# EAGLE design TPS92638 - Breakout (EAGLE 7.7.0)
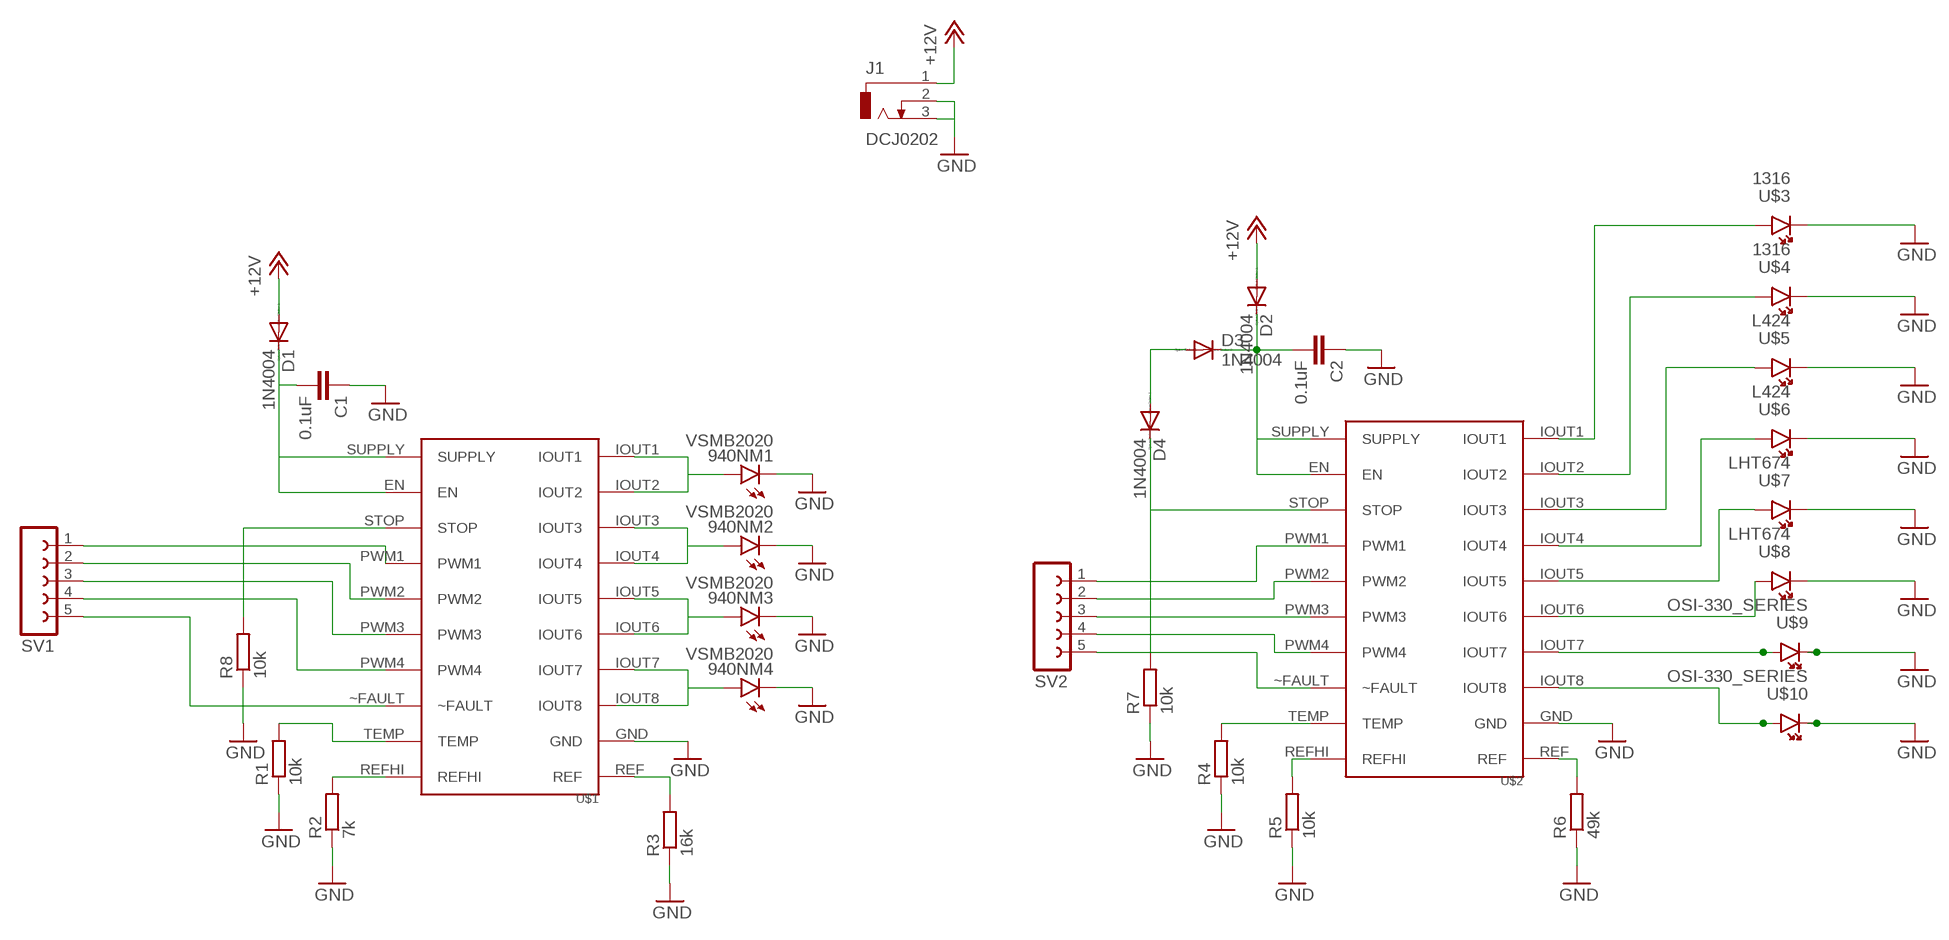
[diagram p0: schematic, sheet 1]

## Parts
940NM1  VSMB2020  [GULLWING-2.3MM]
940NM2  VSMB2020  [GULLWING-2.3MM]
940NM3  VSMB2020  [GULLWING-2.3MM]
940NM4  VSMB2020  [GULLWING-2.3MM]
C1  0.1uF  C-EUC0805  [C0805]
C2  0.1uF  C-EUC0805  [C0805]
D1  1N4004  [DO41-10]
D2  1N4004  [DO41-10]
D3  1N4004  [DO41-10]
D4  1N4004  [DO41-10]
J1  DCJ0202  [DCJ0202]
R1  10k  R-EU_M1206  [M1206]
R2  7k  R-EU_M1206  [M1206]
R3  16k  R-EU_M1206  [M1206]
R4  10k  R-EU_M1206  [M1206]
R5  10k  R-EU_M1206  [M1206]
R6  49k  R-EU_M1206  [M1206]
R7  10k  R-EU_M1206  [M1206]
R8  10k  R-EU_M1206  [M1206]
SV1  FE05-1  [FE05-1]
SV2  FE05-1  [FE05-1]
U$1  TPS92638  [TPS92638]
U$2  TPS92638  [TPS92638]
U$3  1316  [1316]
U$4  1316  [1316]
U$5  L424  [L424]
U$6  L424  [L424]
U$7  LHT674  [LHT674]
U$8  LHT674  [LHT674]
U$9  OSI-330_SERIES  [OSI-330_SERIES]
U$10  OSI-330_SERIES  [OSI-330_SERIES]

## Nets
+12V: D1.A D2.A J1.1
GND: 940NM1.P$2(C) 940NM2.P$2(C) 940NM3.P$2(C) 940NM4.P$2(C) C1.1 C2.1 J1.2 J1.3 R1.1 R2.1 R3.1 R4.1 R5.1 R6.1 R7.1 R8.1 U$1.GND U$2.GND U$3.CATHODE U$4.CATHODE U$5.CATHODE U$6.CATHODE U$7.CATHODE U$8.CATHODE U$9.CATHODE U$10.CATHODE
N$1: SV1.1 U$1.PWM1
N$2: SV1.2 U$1.PWM2
N$3: SV1.3 U$1.PWM3
N$4: SV1.4 U$1.PWM4
N$5: R8.2 U$1.STOP
N$6: SV2.1 U$2.PWM1
N$7: SV2.2 U$2.PWM2
N$8: SV2.3 U$2.PWM3
N$9: SV2.4 U$2.PWM4
N$10: D4.C R7.2 U$2.STOP
N$11: R2.2 U$1.REFHI
N$12: R1.2 U$1.TEMP
N$13: R3.2 U$1.REF
N$14: R4.2 U$2.TEMP
N$15: R5.2 U$2.REFHI
N$16: R6.2 U$2.REF
N$17: C1.2 D1.C U$1.EN U$1.SUPPLY
N$18: C2.2 D2.C D3.C U$2.EN U$2.SUPPLY
N$19: 940NM1.P$1(A) U$1.IOUT1 U$1.IOUT2
N$20: 940NM2.P$1(A) U$1.IOUT3 U$1.IOUT4
N$21: U$2.IOUT1 U$3.ANODE
N$22: 940NM3.P$1(A) U$1.IOUT5 U$1.IOUT6
N$23: 940NM4.P$1(A) U$1.IOUT7
N$24: U$2.IOUT2 U$4.ANODE
N$25: U$2.IOUT3 U$5.ANODE
N$26: U$2.IOUT4 U$6.ANODE
N$27: U$2.IOUT5 U$7.ANODE
N$28: U$2.IOUT6 U$8.ANODE
N$29: U$2.IOUT7 U$9.ANODE
N$30: U$2.IOUT8 U$10.ANODE
N$32: SV1.5 U$1.~FAULT
N$33: SV2.5 U$2.~FAULT
N$34: D3.A D4.A
Unconnected: U$1.IOUT8

## Library data of the parts
940NM1-940NM4 = VS:VSMB2020: VSMB2020X01 - ir led (940nm) in 2.3mm gullwing footprint from Vishay.
C1 C2 = rcl:C-EU: CAPACITOR, European symbol
D1-D4 = diode:1N4004: DIODE general purpose rectifier, 1 A
J1 = con-jack:DCJ0202: DC POWER JACK Source: DCJ0202.pdf; OC_FARNELL: unknown; OC_NEWARK: unknown
R1-R8 = rcl:R-EU_: RESISTOR, European symbol
SV1 SV2 = con-lsta:FE05-1: FEMALE HEADER; OC_FARNELL: unknown; OC_NEWARK: unknown
U$1 U$2 = TPS92638-Q1:TPS92638: The TPS92638-Q1 is an eight-channel linear LED driver with PWM dimming control.
U$3 U$4 = 1316:1316: Flex-System, THT LED’s. The housing is designed to accommodate Ø2mm light guides, i.e. 2000μm fibers and on request 1000μm fibers with a black coating are used.
U$5 U$6 = L424:L424: The Bright Red source color devices are made with Gallium Phosphide Red Light Emitting Diode
U$7 U$8 = LHT674:LHT674: TOPLED, SMT LED with integrated reflector. With our great experience in SMT LED we are able to offer a high quality product for all kind of applications.
U$9 U$10 = OSI-330_series:OSI-330_SERIES: Series 330 - 1206 with Lens IR high intensity 660-850 nm

## Board
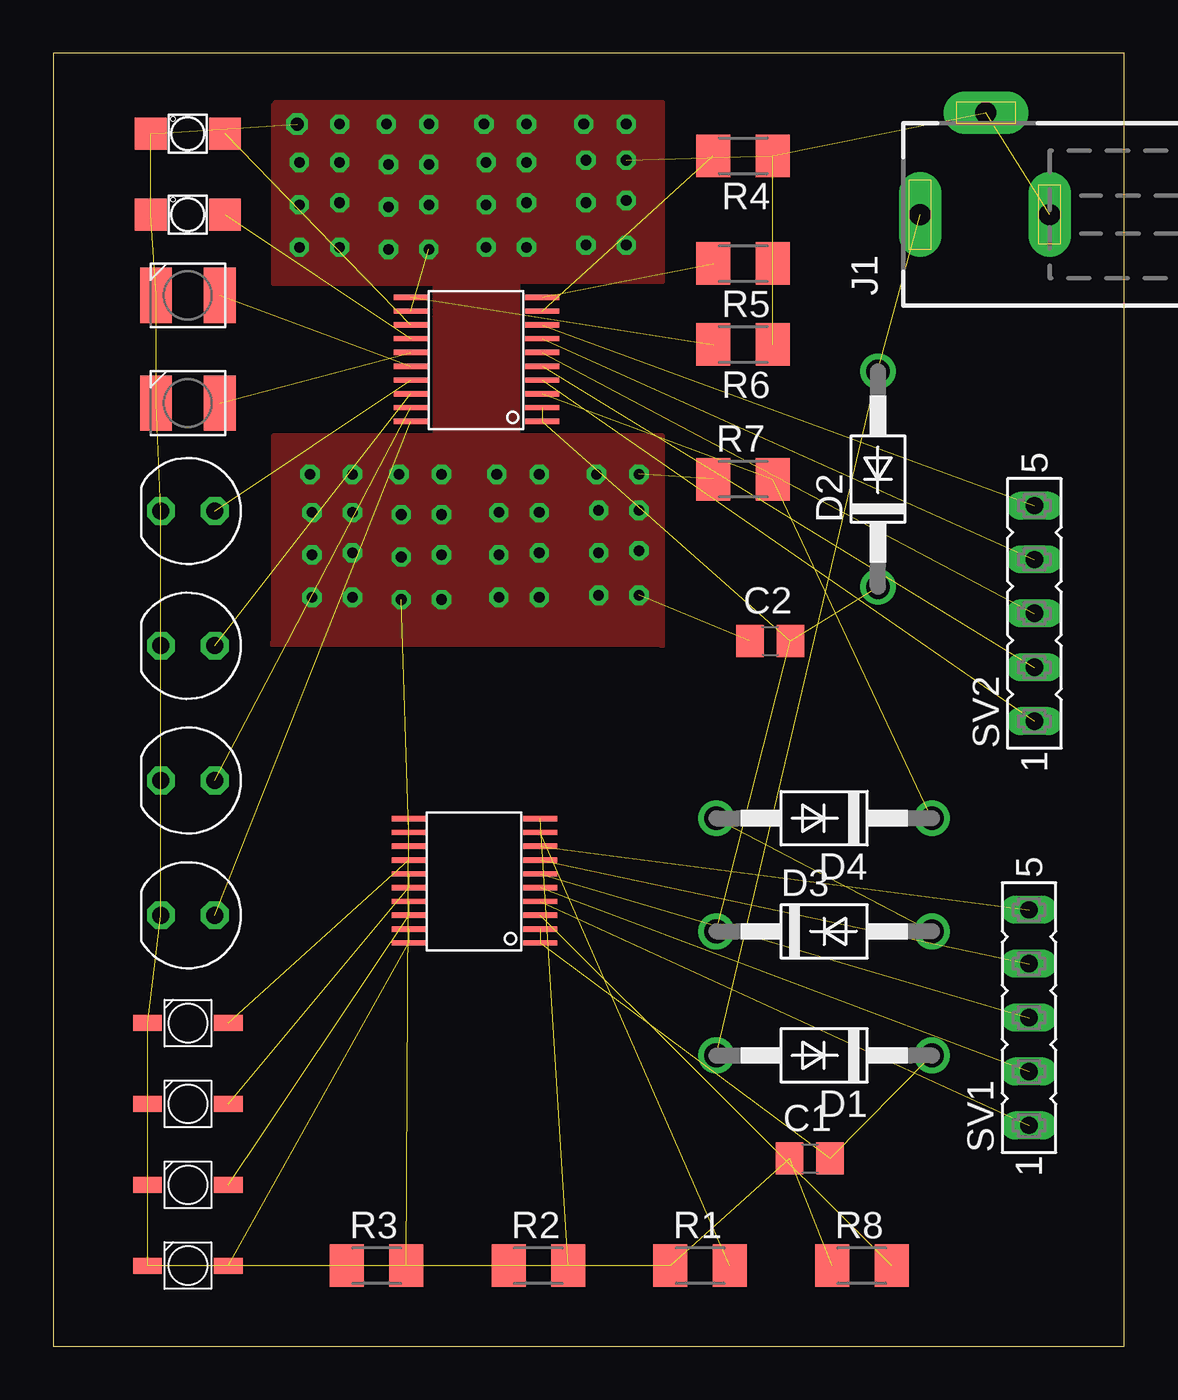
[diagram p1: board, top side]
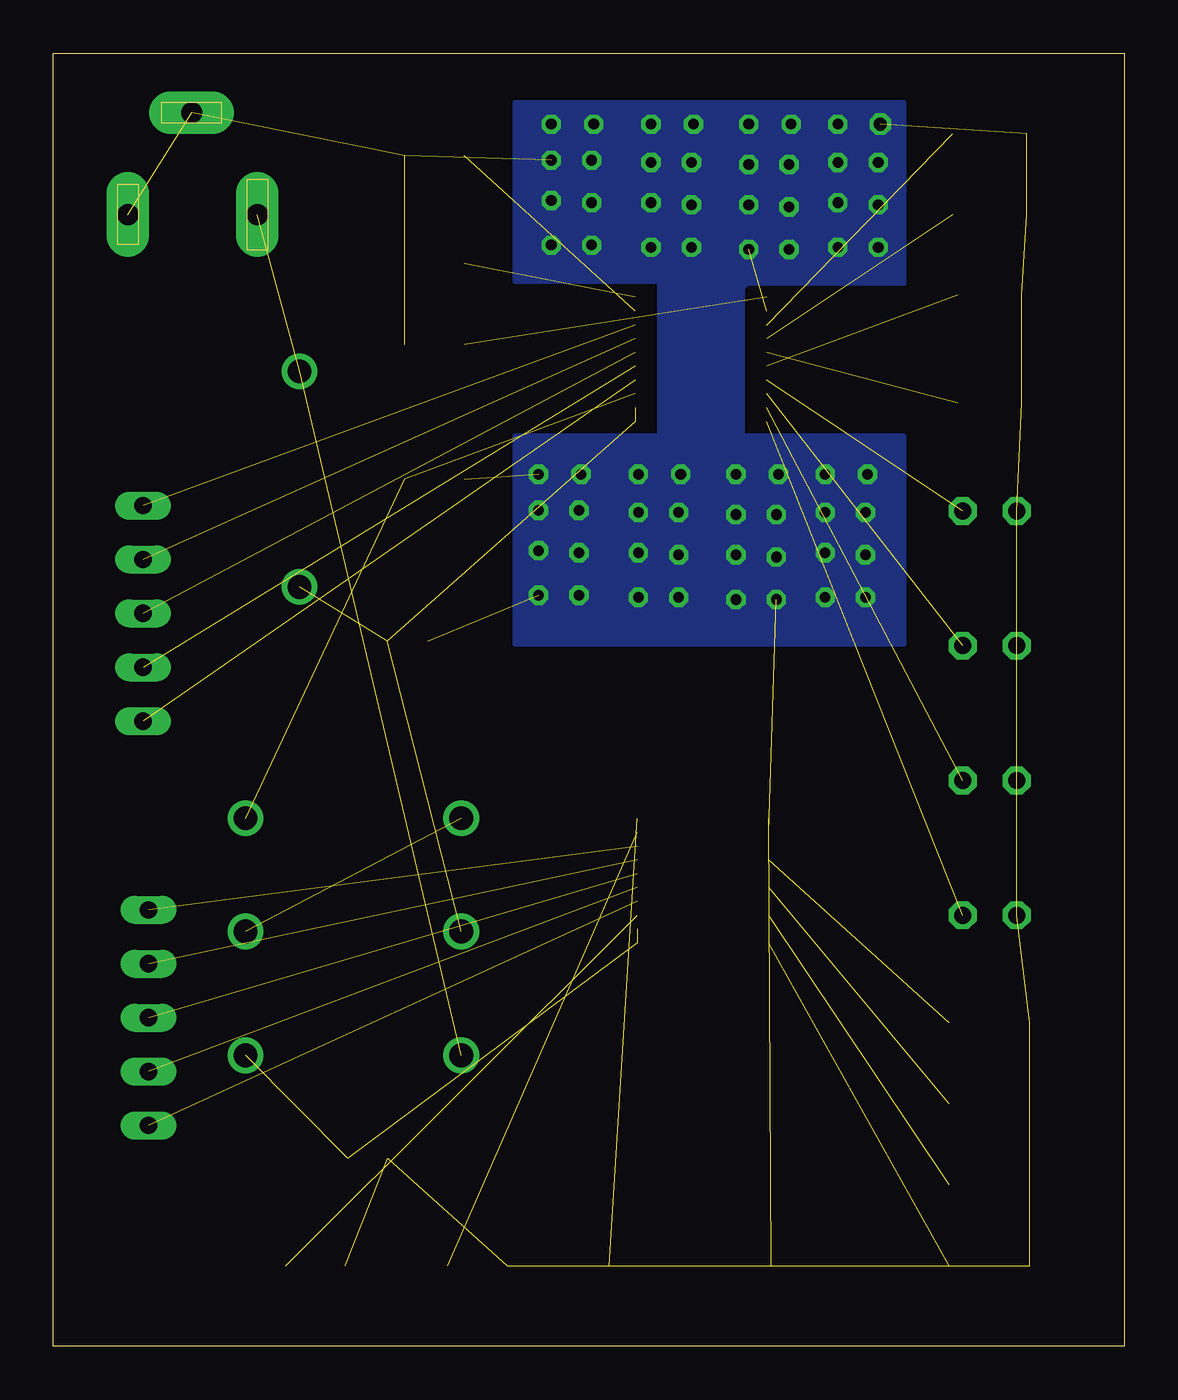
[diagram p2: board, bottom side, seen from below]

Size 50.47 x 60.95 mm. Coordinates in mm from the lower left corner, seen from the top.
Outline: 0,0 50.47,0 50.47,60.95 0,60.95 0,0
Copper layers (1*16): Top 0.035mm / dielectric 1.5mm / Bottom 0.035mm
Design rules "default": minimum track width 10mil, minimum drill 24mil, track to track 8mil, track to pad 8mil, pad to pad 8mil, via to via 8mil, smd to smd 8mil, copper to edge 40mil, drill to drill 8mil, minimum pad ring 10mil, minimum via ring 8mil, stop-mask expansion 4mil, vias tented up to drill 0mil, thermal gap 10mil

### Footprints (pad centres in the part's own frame; a part is rotated, then mirrored left to right if it is on the bottom)
GULLWING-2.3MM = smd 1.35 x 0.75: P$1 -1.9,0; P$2 1.9,0
C0805 = smd 1.3 x 1.5: 1 -0.95,0; 2 0.95,0
DO41-10 = drill 1.118: A 5.08,0; C -5.08,0
DCJ0202 = drill 1 pad 2 long: 1 0,3.1; 2 4.8,0; 3 0,-3
M1206 = smd 1.6 x 2: 1 -1.4,0; 2 1.4,0
FE05-1 = drill 0.813 long: 1 -5.08,0; 2 -2.54,0; 3 0,0; 4 2.54,0; 5 5.08,0
TPS92638 = smd 0.25 x 1.6: EN -2.25,-3.1; GND 2.3,3.1; IOUT1 -2.9,3.1; IOUT2 -2.25,3.1; IOUT3 -1.6,3.1; IOUT4 -0.95,3.1; IOUT5 -0.3,3.1; IOUT6 0.35,3.1; IOUT7 1,3.1; IOUT8 1.65,3.1; PWM1 -0.95,-3.1; PWM2 -0.3,-3.1; PWM3 0.35,-3.1; PWM4 1,-3.1; REF 2.95,3.1; REFHI 2.95,-3.1; STOP -1.6,-3.1; SUPPLY -2.9,-3.1; TEMP 2.3,-3.1; ~FAULT 1.65,-3.1
1316 = drill 0.8 octagon: ANODE -1.27,0; CATHODE 1.27,0
L424 = drill 0.8 octagon: ANODE -1.27,0; CATHODE 1.27,0
LHT674 = smd 1.5 x 2.6: ANODE -1.5,0; CATHODE 1.5,0
OSI-330_SERIES = smd 1.5 x 1.5: ANODE -1.75,0; CATHODE 1.75,0

### Placement (x,y rotation side)
940NM1  6.35,3.81 180 top
940NM2  6.35,7.62 180 top
940NM3  6.35,11.43 180 top
940NM4  6.35,15.24 180 top
C1  35.65,8.86 0 top
C2  33.78,33.25 0 top
D1  36.32,13.72 180 top
D2  38.86,40.87 90 top
D3  36.32,19.56 0 top
D4  36.32,24.89 180 top
J1  43.94,53.34 90 top
R1  30.48,3.81 0 top
R2  22.86,3.81 0 top
R3  15.24,3.81 0 top
R4  32.51,56.11 180 top
R5  32.51,51.03 180 top
R6  32.51,47.22 180 top
R7  32.51,40.87 0 top
R8  38.1,3.81 0 top
SV1  45.97,15.49 90 top
SV2  46.23,34.54 90 top
U$1  19.85,21.92 90 top
U$2  19.95,46.49 90 top
U$3  6.35,20.32 180 top
U$4  6.35,26.67 180 top
U$5  6.35,33.02 180 top
U$6  6.35,39.37 180 top
U$7  6.35,49.53 180 top
U$8  6.35,44.45 180 top
U$9  6.35,53.34 180 top
U$10  6.35,57.15 180 top

### Tracks (layer width: path | path; a pad name or v marks a point on that pad's centre or on a via)
+12V  (2 unrouted)
GND  (via drill 0.5 pad 0.25, 0.61 pad 0.25)  (26 unrouted)
  other vias: 11.5,57.6 15.7,57.6 17.7,57.6 20.3,57.6 22.3,57.6 13.5,57.6 25,57.6 27,57.6 11.6,55.8 13.5,55.8 15.8,55.7 17.7,55.7 20.4,55.8 22.3,55.8 25.1,55.9 27,55.9 11.6,53.8 13.5,53.9 15.8,53.7 17.7,53.8 20.4,53.8 22.3,53.9 25.1,53.9 27,54 11.6,51.8 13.5,51.8 15.8,51.7 17.7,51.7 20.4,51.8 22.3,51.8 25.1,51.9 27,51.9 14.1,41.1 12.1,41.1 16.3,41.1 18.3,41.1 20.9,41.1 22.9,41.1 25.6,41.1 27.6,41.1 27.6,39.4 25.7,39.4 22.9,39.3 21,39.3 18.3,39.2 16.4,39.2 14.1,39.3 12.2,39.3 12.2,37.3 14.1,37.4 16.4,37.2 18.3,37.3 21,37.3 22.9,37.4 25.7,37.4 27.6,37.5 12.2,35.3 14.1,35.3 16.4,35.2 18.3,35.2 21,35.3 22.9,35.3 25.7,35.4 27.6,35.4
  pour Top: 18,49.5 18,42.9 10.4,42.9 10.4,33.2 10.3,33.1 28.5,33.1 28.6,33.1 28.7,33 28.7,42.7 28.7,42.9 21.9,42.9 21.9,50.2 28.7,50.2 28.7,58.6 10.5,58.6 10.4,58.5 10.4,50.1 18,50.1
  pour Bottom: 18,49.9 18,42.9 10.4,42.9 10.4,33.1 28.7,33.1 28.7,42.9 21.9,42.9 21.9,50.2 28.7,50.2 28.7,58.6 10.4,58.6 10.4,50.1 17.8,50.1
N$1  (1 unrouted)
N$2  (1 unrouted)
N$3  (1 unrouted)
N$4  (1 unrouted)
N$5  (1 unrouted)
N$6  (1 unrouted)
N$7  (1 unrouted)
N$8  (1 unrouted)
N$9  (1 unrouted)
N$10  (2 unrouted)
N$11  (1 unrouted)
N$12  (1 unrouted)
N$13  (1 unrouted)
N$14  (1 unrouted)
N$15  (1 unrouted)
N$16  (1 unrouted)
N$17  (3 unrouted)
N$18  (4 unrouted)
N$19  (2 unrouted)
N$20  (2 unrouted)
N$21  (1 unrouted)
N$22  (2 unrouted)
N$23  (1 unrouted)
N$24  (1 unrouted)
N$25  (1 unrouted)
N$26  (1 unrouted)
N$27  (1 unrouted)
N$28  (1 unrouted)
N$29  (1 unrouted)
N$30  (1 unrouted)
N$32  (1 unrouted)
N$33  (1 unrouted)
N$34  (1 unrouted)